# Altium schematic sheet FPGA.SchDoc
size A3; DocumentNumber: 4; SheetNumber: 4; SheetTotal: 4
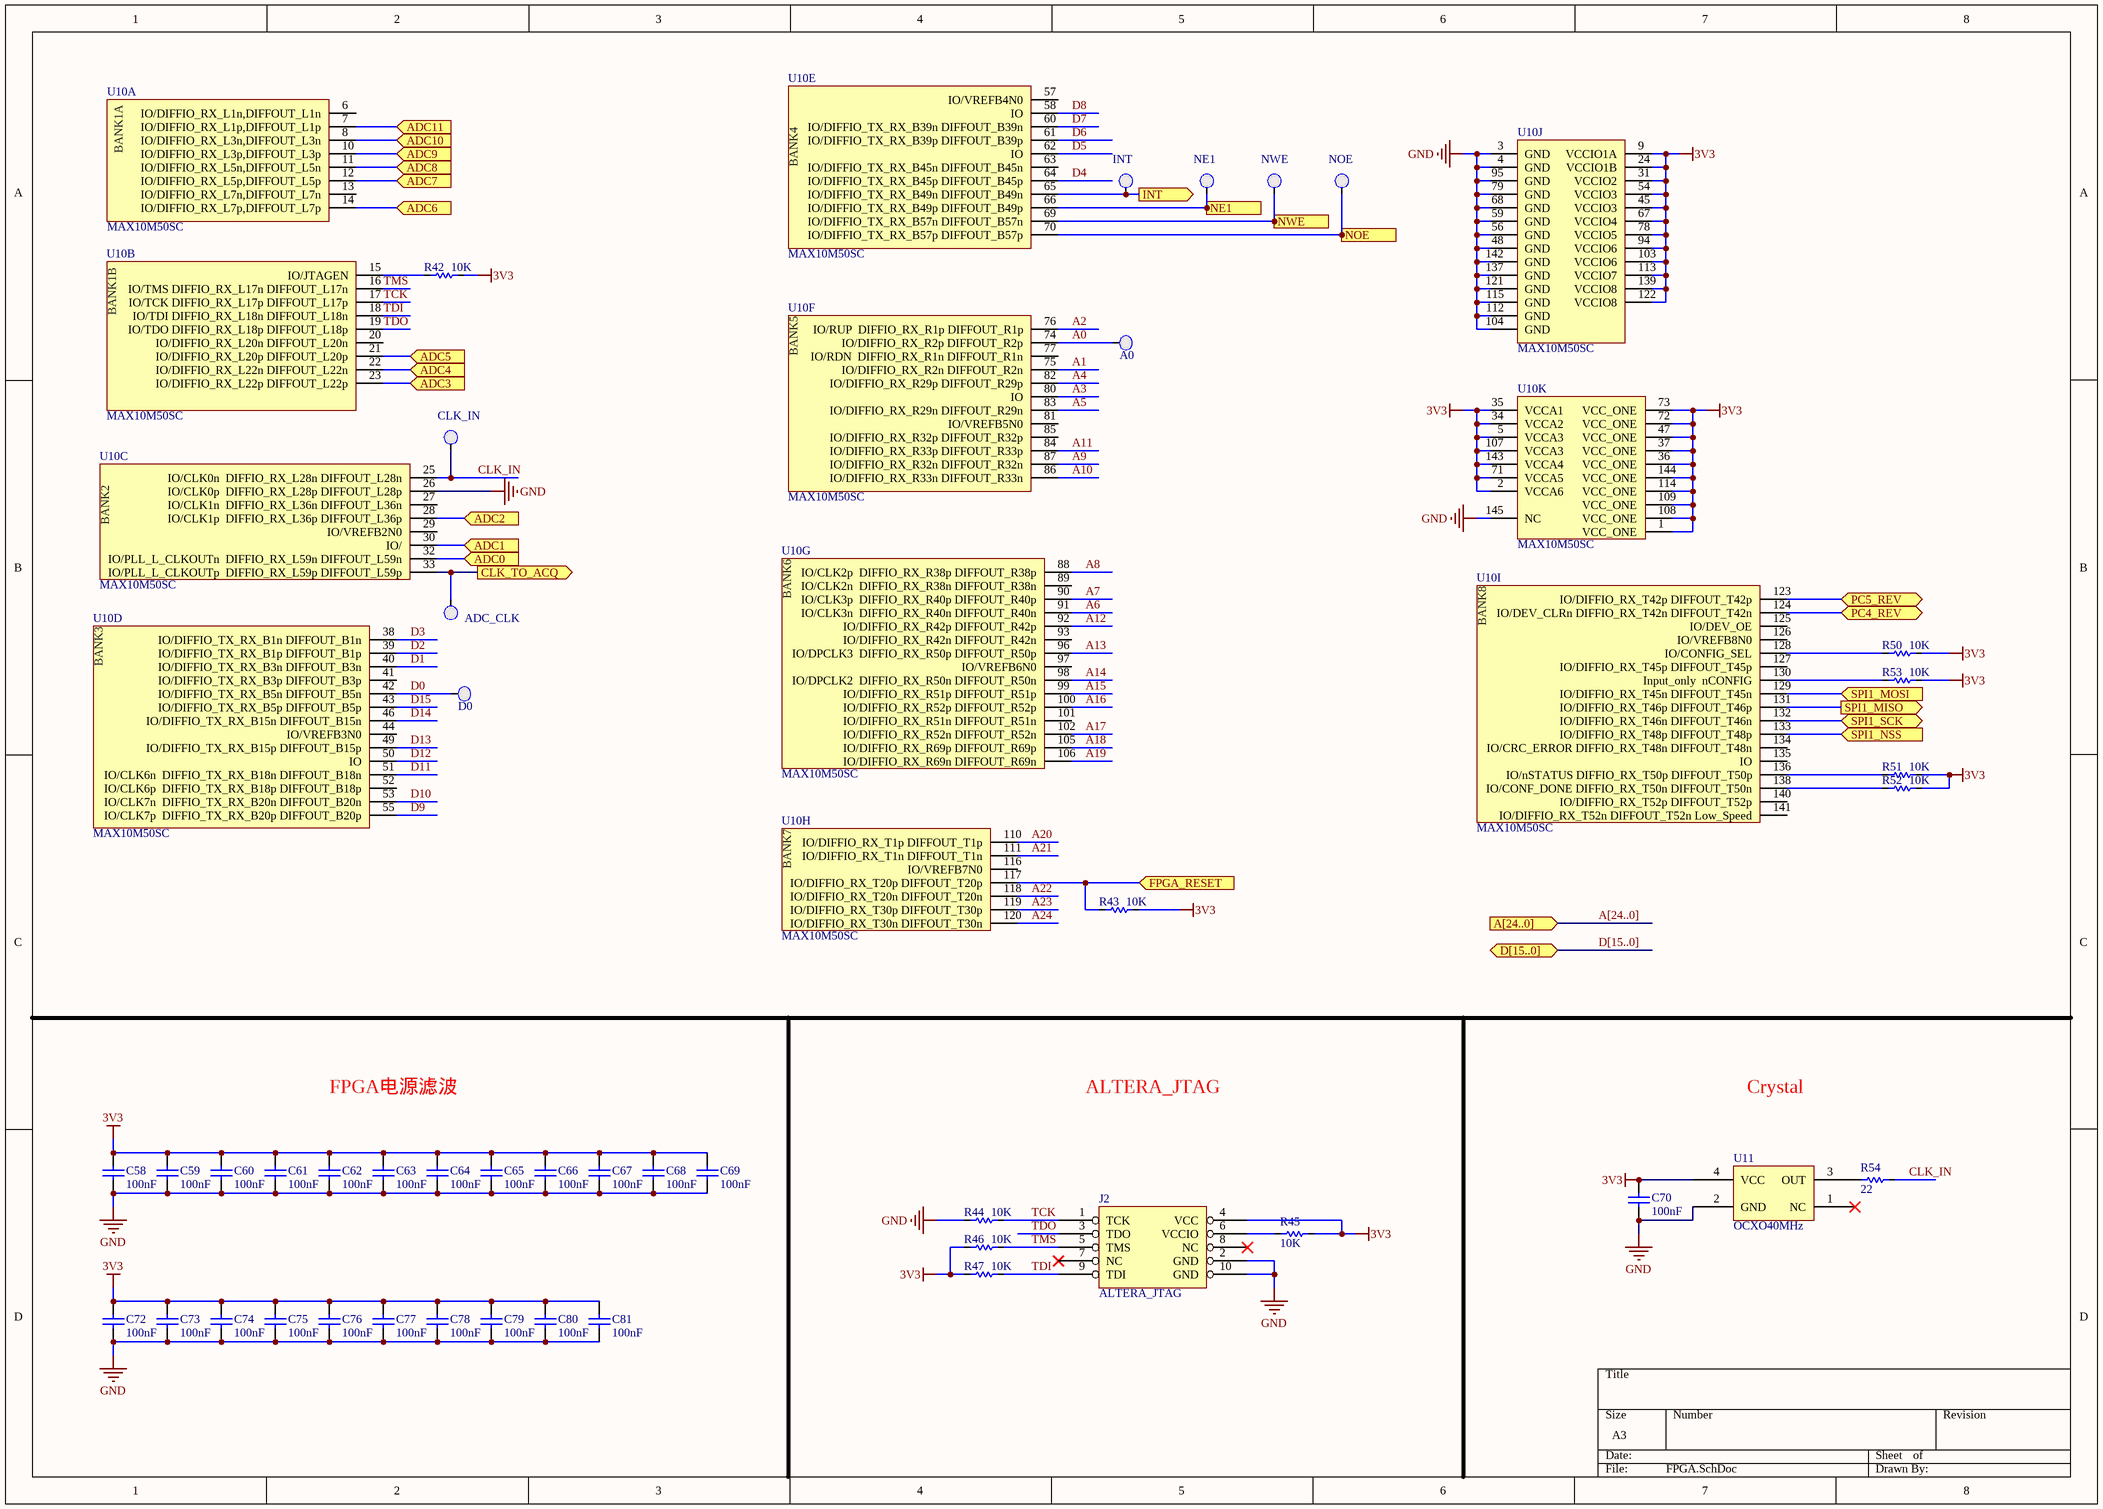
[diagram p0: FPGA.SchDoc]

## Parts
A0  TP  [TPA]  (value not drawn)
ADC_CLK  TP  [TPA]  (value not drawn)
C58  100nF  [0805C]
C59  100nF  [0805C]
C60  100nF  [0805C]
C61  100nF  [0805C]
C62  100nF  [0805C]
C63  100nF  [0805C]
C64  100nF  [0805C]
C65  100nF  [0805C]
C66  100nF  [0805C]
C67  100nF  [0805C]
C68  100nF  [0805C]
C69  100nF  [0805C]
C70  100nF  [0805C]
C72  100nF  [0805C]
C73  100nF  [0805C]
C74  100nF  [0805C]
C75  100nF  [0805C]
C76  100nF  [0805C]
C77  100nF  [0805C]
C78  100nF  [0805C]
C79  100nF  [0805C]
C80  100nF  [0805C]
C81  100nF  [0805C]
CLK_IN  TP  [TPA]  (value not drawn)
D0  TP  [TPA]  (value not drawn)
INT  TP  [TPA]  (value not drawn)
J2  ALTERA_JTAG  [JTAG_DIP]
NE1  TP  [TPA]  (value not drawn)
NOE  TP  [TPA]  (value not drawn)
NWE  TP  [TPA]  (value not drawn)
R42  10K  [0805R]
R43  10K  [0805R]
R44  10K  [0805R]
R45  10K  [0805R]
R46  10K  [0805R]
R47  10K  [0805R]
R50  10K  [0805R]
R51  10K  [0805R]
R52  10K  [0805R]
R53  10K  [0805R]
R54  22  [0805R]
U10  MAX10M50SC  [max10M50sc_Quad144]  (parts A,B,C,D,E,F,G,H,I,J,K of 11)
U11  OCXO40MHz  [OCX1]

## Ports
A[24..0] (in), ADC0 (in), ADC1 (in), ADC2 (in), ADC3 (in), ADC4 (in), ADC5 (in), ADC6 (in), ADC7 (in), ADC8 (in), ADC9 (in), ADC10 (in), ADC11 (in), CLK_TO_ACQ (out), D[15..0] (bidir), FPGA_RESET (in), INT (out), NE1 (in), NOE (in), NWE (in), PC4_REV (bidir), PC5_REV (bidir), SPI1_MISO (out), SPI1_MOSI (in), SPI1_NSS (in), SPI1_SCK (bidir)

## Nets
3V3: C58.2 C59.2 C60.2 C61.2 C62.2 C63.2 C64.2 C65.2 C66.2 C67.2 C68.2 C69.2 C70.2 C72.2 C73.2 C74.2 C75.2 C76.2 C77.2 C78.2 C79.2 C80.2 C81.2 J2.4(VCC) R42.2 R43.2 R45.2 R46.1 R47.1 R50.2 R51.2 R52.2 R53.2 U10.1(VCC_ONE) U10.2(VCCA6) U10.5(VCCA3) U10.9(VCCIO1A) U10.24(VCCIO1B) U10.31(VCCIO2) U10.34(VCCA2) U10.35(VCCA1) U10.36(VCC_ONE) U10.37(VCC_ONE) U10.45(VCCIO3) U10.47(VCC_ONE) U10.54(VCCIO3) U10.67(VCCIO4) U10.71(VCCA5) U10.72(VCC_ONE) U10.73(VCC_ONE) U10.78(VCCIO5) U10.94(VCCIO6) U10.103(VCCIO6) U10.107(VCCA3) U10.108(VCC_ONE) U10.109(VCC_ONE) U10.113(VCCIO7) U10.114(VCC_ONE) U10.122(VCCIO8) U10.139(VCCIO8) U10.143(VCCA4) U10.144(VCC_ONE) U11.4(VCC)
GND: C58.1 C59.1 C60.1 C61.1 C62.1 C63.1 C64.1 C65.1 C66.1 C67.1 C68.1 C69.1 C70.1 C72.1 C73.1 C74.1 C75.1 C76.1 C77.1 C78.1 C79.1 C80.1 C81.1 J2.2(GND) J2.10(GND) R44.1 U10.3(GND) U10.4(GND) U10.26(IO/CLK0p__DIFFIO_RX_L28p_DIFFOUT_L28p) U10.48(GND) U10.56(GND) U10.59(GND) U10.68(GND) U10.79(GND) U10.95(GND) U10.104(GND) U10.112(GND) U10.115(GND) U10.121(GND) U10.137(GND) U10.142(GND) U10.145(NC) U11.2(GND)
A0: A0.1(TP) U10.74(IO/DIFFIO_RX_R2p_DIFFOUT_R2p)
A1: U10.75(IO/DIFFIO_RX_R2n_DIFFOUT_R2n)
A2: U10.76(IO/RUP__DIFFIO_RX_R1p_DIFFOUT_R1p)
A3: U10.80(IO)
A4: U10.82(IO/DIFFIO_RX_R29p_DIFFOUT_R29p)
A5: U10.83(IO/DIFFIO_RX_R29n_DIFFOUT_R29n)
A6: U10.91(IO/CLK3n__DIFFIO_RX_R40n_DIFFOUT_R40n)
A7: U10.90(IO/CLK3p__DIFFIO_RX_R40p_DIFFOUT_R40p)
A8: U10.88(IO/CLK2p__DIFFIO_RX_R38p_DIFFOUT_R38p)
A9: U10.87(IO/DIFFIO_RX_R32n_DIFFOUT_R32n)
A10: U10.86(IO/DIFFIO_RX_R33n_DIFFOUT_R33n)
A11: U10.84(IO/DIFFIO_RX_R33p_DIFFOUT_R33p)
A12: U10.92(IO/DIFFIO_RX_R42p_DIFFOUT_R42p)
A13: U10.96(IO/DPCLK3__DIFFIO_RX_R50p_DIFFOUT_R50p)
A14: U10.98(IO/DPCLK2__DIFFIO_RX_R50n_DIFFOUT_R50n)
A15: U10.99(IO/DIFFIO_RX_R51p_DIFFOUT_R51p)
A16: U10.100(IO/DIFFIO_RX_R52p_DIFFOUT_R52p)
A17: U10.102(IO/DIFFIO_RX_R52n_DIFFOUT_R52n)
A18: U10.105(IO/DIFFIO_RX_R69p_DIFFOUT_R69p)
A19: U10.106(IO/DIFFIO_RX_R69n_DIFFOUT_R69n)
A20: U10.110(IO/DIFFIO_RX_T1p_DIFFOUT_T1p)
A21: U10.111(IO/DIFFIO_RX_T1n_DIFFOUT_T1n)
A22: U10.118(IO/DIFFIO_RX_T20n_DIFFOUT_T20n)
A23: U10.119(IO/DIFFIO_RX_T30p_DIFFOUT_T30p)
A24: U10.120(IO/DIFFIO_RX_T30n_DIFFOUT_T30n)
ADC0: U10.32(IO/PLL_L_CLKOUTn__DIFFIO_RX_L59n_DIFFOUT_L59n) ; port ADC0
ADC1: U10.30(IO/) ; port ADC1
ADC2: U10.28(IO/CLK1p__DIFFIO_RX_L36p_DIFFOUT_L36p) ; port ADC2
ADC3: U10.23(IO/DIFFIO_RX_L22p_DIFFOUT_L22p) ; port ADC3
ADC4: U10.22(IO/DIFFIO_RX_L22n_DIFFOUT_L22n) ; port ADC4
ADC5: U10.21(IO/DIFFIO_RX_L20p_DIFFOUT_L20p) ; port ADC5
ADC6: U10.14(IO/DIFFIO_RX_L7p,DIFFOUT_L7p) ; port ADC6
ADC7: U10.12(IO/DIFFIO_RX_L5p,DIFFOUT_L5p) ; port ADC7
ADC8: U10.11(IO/DIFFIO_RX_L5n,DIFFOUT_L5n) ; port ADC8
ADC9: U10.10(IO/DIFFIO_RX_L3p,DIFFOUT_L3p) ; port ADC9
ADC10: U10.8(IO/DIFFIO_RX_L3n,DIFFOUT_L3n) ; port ADC10
ADC11: U10.7(IO/DIFFIO_RX_L1p,DIFFOUT_L1p) ; port ADC11
CLK_IN: CLK_IN.1(TP) R54.2 U10.25(IO/CLK0n__DIFFIO_RX_L28n_DIFFOUT_L28n)
CLK_TO_ACQ: ADC_CLK.1(TP) U10.33(IO/PLL_L_CLKOUTp__DIFFIO_RX_L59p_DIFFOUT_L59p) ; port CLK_TO_ACQ
D0: D0.1(TP) U10.42(IO/DIFFIO_TX_RX_B5n_DIFFOUT_B5n)
D1: U10.40(IO/DIFFIO_TX_RX_B3n_DIFFOUT_B3n)
D2: U10.39(IO/DIFFIO_TX_RX_B1p_DIFFOUT_B1p)
D3: U10.38(IO/DIFFIO_TX_RX_B1n_DIFFOUT_B1n)
D4: U10.64(IO/DIFFIO_TX_RX_B45p_DIFFOUT_B45p)
D5: U10.62(IO)
D6: U10.61(IO/DIFFIO_TX_RX_B39p_DIFFOUT_B39p)
D7: U10.60(IO/DIFFIO_TX_RX_B39n_DIFFOUT_B39n)
D8: U10.58(IO)
D9: U10.55(IO/CLK7p__DIFFIO_TX_RX_B20p_DIFFOUT_B20p)
D10: U10.53(IO/CLK7n__DIFFIO_TX_RX_B20n_DIFFOUT_B20n)
D11: U10.51(IO/CLK6n__DIFFIO_TX_RX_B18n_DIFFOUT_B18n)
D12: U10.50(IO)
D13: U10.49(IO/DIFFIO_TX_RX_B15p_DIFFOUT_B15p)
D14: U10.46(IO/DIFFIO_TX_RX_B15n_DIFFOUT_B15n)
D15: U10.43(IO/DIFFIO_TX_RX_B5p_DIFFOUT_B5p)
FPGA_RESET: R43.1 U10.117(IO/DIFFIO_RX_T20p_DIFFOUT_T20p) ; port FPGA_RESET
INT: INT.1(TP) U10.65(IO/DIFFIO_TX_RX_B49n_DIFFOUT_B49n) ; port INT
NE1: NE1.1(TP) U10.66(IO/DIFFIO_TX_RX_B49p_DIFFOUT_B49p) ; port NE1
NOE: NOE.1(TP) U10.70(IO/DIFFIO_TX_RX_B57p_DIFFOUT_B57p) ; port NOE
NWE: NWE.1(TP) U10.69(IO/DIFFIO_TX_RX_B57n_DIFFOUT_B57n) ; port NWE
PC4_REV: U10.124(IO/DEV_CLRn_DIFFIO_RX_T42n_DIFFOUT_T42n) ; port PC4_REV
PC5_REV: U10.123(IO/DIFFIO_RX_T42p_DIFFOUT_T42p) ; port PC5_REV
SPI1_MISO: U10.131(IO/DIFFIO_RX_T46p_DIFFOUT_T46p) ; port SPI1_MISO
SPI1_MOSI: U10.129(IO/DIFFIO_RX_T45n_DIFFOUT_T45n) ; port SPI1_MOSI
SPI1_NSS: U10.133(IO/DIFFIO_RX_T48p_DIFFOUT_T48p) ; port SPI1_NSS
SPI1_SCK: U10.132(IO/DIFFIO_RX_T46n_DIFFOUT_T46n) ; port SPI1_SCK
TCK: J2.1(TCK) R44.2 U10.17(IO/TCK_DIFFIO_RX_L17p_DIFFOUT_L17p)
TDI: J2.9(TDI) R47.2 U10.18(IO/TDI_DIFFIO_RX_L18n_DIFFOUT_L18n)
TDO: J2.3(TDO) U10.19(IO/TDO_DIFFIO_RX_L18p_DIFFOUT_L18p)
TMS: J2.5(TMS) R46.2 U10.16(IO/TMS_DIFFIO_RX_L17n_DIFFOUT_L17n)
NetJ2_6: J2.6(VCCIO) R45.1
NetR42_1: R42.1 U10.15(IO/JTAGEN)
NetR50_1: R50.1 U10.128(IO/CONFIG_SEL)
NetR51_1: R51.1 U10.136(IO/nSTATUS_DIFFIO_RX_T50p_DIFFOUT_T50p)
NetR52_1: R52.1 U10.138(IO/CONF_DONE_DIFFIO_RX_T50n_DIFFOUT_T50n)
NetR53_1: R53.1 U10.130(Input_only__nCONFIG)
NetR54_1: R54.1 U11.3(OUT)

Not connected (* = marked no-connect by the designer): J2 7(NC)* 8(NC)*; U10 6(IO/DIFFIO_RX_L1n,DIFFOUT_L1n) 13(IO/DIFFIO_RX_L7n,DIFFOUT_L7n) 20(IO/DIFFIO_RX_L20n_DIFFOUT_L20n) 27(IO/CLK1n__DIFFIO_RX_L36n_DIFFOUT_L36n) 29(IO/VREFB2N0) 41(IO/DIFFIO_TX_RX_B3p_DIFFOUT_B3p) 44(IO/VREFB3N0) 52(IO/CLK6p__DIFFIO_TX_RX_B18p_DIFFOUT_B18p) 57(IO/VREFB4N0) 63(IO/DIFFIO_TX_RX_B45n_DIFFOUT_B45n) 77(IO/RDN__DIFFIO_RX_R1n_DIFFOUT_R1n) 81(IO/VREFB5N0) 85(IO/DIFFIO_RX_R32p_DIFFOUT_R32p) 89(IO/CLK2n__DIFFIO_RX_R38n_DIFFOUT_R38n) 93(IO/DIFFIO_RX_R42n_DIFFOUT_R42n) 97(IO/VREFB6N0) 101(IO/DIFFIO_RX_R51n_DIFFOUT_R51n) 116(IO/VREFB7N0) 125(IO/DEV_OE) 126(IO/VREFB8N0) 127(IO/DIFFIO_RX_T45p_DIFFOUT_T45p) 134(IO/CRC_ERROR_DIFFIO_RX_T48n_DIFFOUT_T48n) 135(IO) 140(IO/DIFFIO_RX_T52p_DIFFOUT_T52p) 141(IO/DIFFIO_RX_T52n_DIFFOUT_T52n_Low_Speed); U11 1(NC)*

## Buses and harness runs
bus A[24..0] = port A[24..0]
bus D[15..0] = port D[15..0]

## Notes on the sheet
- FPGA电源滤波
- ALTERA_JTAG
- Crystal
- (in symbol MAX10M50SC_144, part A) BANK1A
- (in symbol MAX10M50SC_144, part B) BANK1B
- (in symbol MAX10M50SC_144, part C) BANK2
- (in symbol MAX10M50SC_144, part D) BANK3
- (in symbol MAX10M50SC_144, part E) BANK4
- (in symbol MAX10M50SC_144, part F) BANK5
- (in symbol MAX10M50SC_144, part G) BANK6
- (in symbol MAX10M50SC_144, part H) BANK7
- (in symbol MAX10M50SC_144, part I) BANK8

## Library data of the parts
C58-C70 C72-C81 = Cap: Capacitor; Published: 8-Jun-2000; LatestRevisionDate: 17-Jul-2002; LatestRevisionNote: Re-released for DXP Platform.; PackageReference: RAD-0.3; Publisher: Altium Limited; PackageDescription: Radial Cap, Thru-Hole; 2 Leads; 0.3 in Pin Spacing; Value: 100nF
R42-R47 R50-R54 = Res1: Resistor; Published: 8-Jun-2000; LatestRevisionDate: 17-Jul-2002; LatestRevisionNote: Re-released for DXP Platform.; PackageReference: AXIAL-0.3; Publisher: Altium Limited; PackageDescription: Axial Device, Thru-Hole; 2 Leads; 0.3 in Pin Spacing
  R42-R47 R50-R53: Value: 10K
  R54: Value: 22
U10 = MAX10M50SC_144
U11 = OCXO